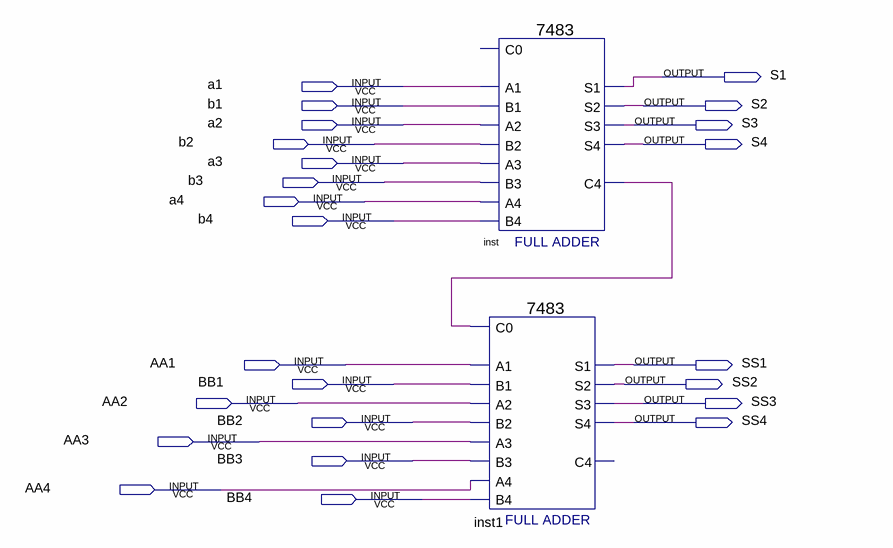
[diagram p0: schematic sheet]
// Quartus schematic SUMA.bdf as structural Verilog: 2 symbols, 24 pins
module SUMA (
  input  a1,
  input  b1,
  input  a2,
  input  b2,
  input  a3,
  input  b3,
  input  a4,
  input  b4,
  input  AA1,
  input  BB1,
  input  AA2,
  input  BB2,
  input  AA3,
  input  BB3,
  input  AA4,
  input  BB4,
  output S1,
  output S2,
  output S3,
  output S4,
  output SS1,
  output SS2,
  output SS3,
  output SS4
);

  wire inst_c4;

  \7483  inst (
    .B4(b4), .A1(a1), .A2(a2), .B1(b1), .B2(b2), .A3(a3), .B3(b3), .A4(a4), .S3(S3), .S4(S4), .S2(S2),
    .C4(inst_c4), .S1(S1));  // open: C0
  \7483  inst1 (
    .B4(BB4), .C0(inst_c4), .A1(AA1), .A2(AA2), .B1(BB1), .B2(BB2), .A3(AA3), .B3(BB3), .A4(AA4), .S3(SS3),
    .S4(SS4), .S2(SS2), .S1(SS1));  // open: C4
endmodule
